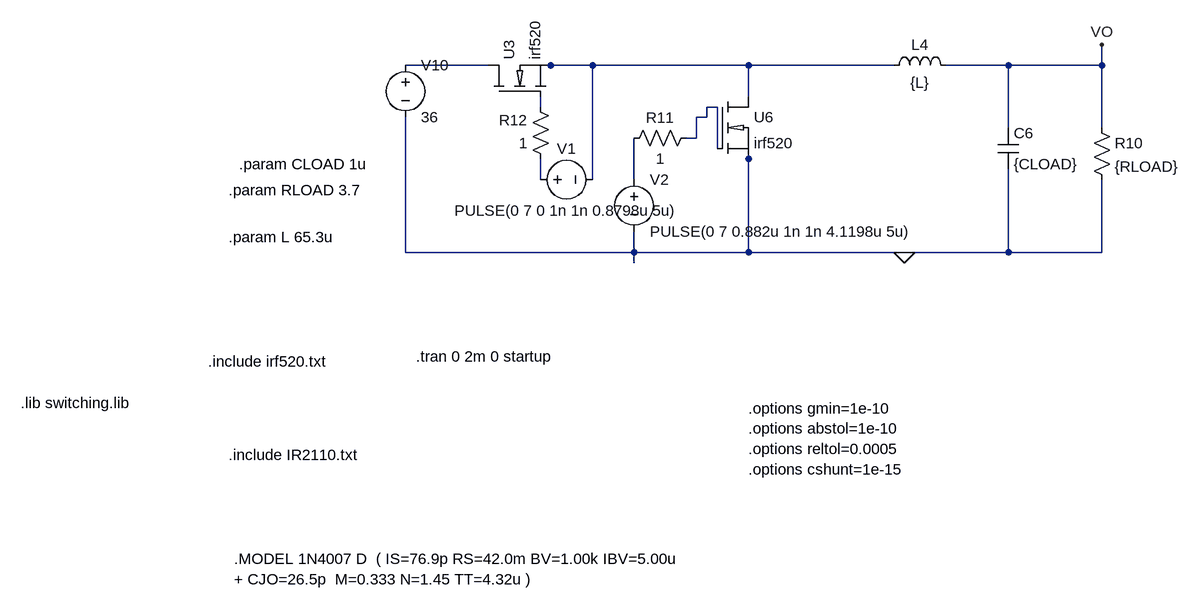
[diagram p0: schematic buck_ideal.asc]
buck_ideal.asc, the LTspice schematic file:
Version 4
SHEET 1 4676 680
WIRE 240 -992 112 -992
WIRE 336 -992 304 -992
WIRE 400 -992 336 -992
WIRE 640 -992 400 -992
WIRE 864 -992 640 -992
WIRE 1040 -992 944 -992
WIRE 1184 -992 1184 -1024
WIRE 1184 -992 1040 -992
WIRE 640 -944 640 -992
WIRE 320 -928 320 -944
WIRE 592 -928 576 -928
WIRE 576 -912 576 -928
WIRE 576 -912 560 -912
WIRE 1040 -896 1040 -992
WIRE 1184 -896 1184 -992
WIRE 560 -880 560 -912
WIRE 560 -880 544 -880
WIRE 592 -864 592 -928
WIRE 640 -848 640 -864
WIRE 320 -816 320 -848
WIRE 400 -816 400 -992
WIRE 464 -816 464 -880
WIRE 112 -704 112 -912
WIRE 464 -704 464 -736
WIRE 464 -704 112 -704
WIRE 640 -704 640 -848
WIRE 640 -704 464 -704
WIRE 880 -704 640 -704
WIRE 1040 -704 1040 -832
WIRE 1040 -704 880 -704
WIRE 1184 -704 1184 -816
WIRE 1184 -704 1040 -704
WIRE 464 -688 464 -704
FLAG 880 -704 0
FLAG 1184 -1024 VO
SYMBOL voltage 112 -1008 R0
WINDOW 123 0 0 Left 0
WINDOW 39 0 0 Left 0
SYMATTR InstName V10
SYMATTR Value 36
SYMBOL ind 848 -976 R270
WINDOW 0 32 56 VTop 2
WINDOW 3 5 56 VBottom 2
SYMATTR InstName L4
SYMATTR Value {L}
SYMBOL cap 1024 -896 R0
SYMATTR InstName C6
SYMATTR Value {CLOAD}
SYMBOL res 1168 -912 R0
SYMATTR InstName R10
SYMATTR Value {RLOAD}
SYMBOL irf520 240 -944 R270
SYMATTR InstName U3
SYMBOL irf520 592 -944 R0
SYMATTR InstName U6
SYMBOL res 560 -896 R90
WINDOW 0 0 56 VBottom 2
WINDOW 3 32 56 VTop 2
SYMATTR InstName R11
SYMATTR Value 1
SYMBOL res 336 -832 R180
WINDOW 0 36 76 Left 2
WINDOW 3 36 40 Left 2
SYMATTR InstName R12
SYMATTR Value 1
SYMBOL voltage 304 -816 R270
WINDOW 0 32 56 VTop 2
WINDOW 3 -32 56 VBottom 2
WINDOW 123 0 0 Left 0
WINDOW 39 0 0 Left 0
SYMATTR InstName V1
SYMATTR Value PULSE(0 7 0 1n 1n 0.8798u 5u)
SYMBOL voltage 464 -832 R0
WINDOW 123 0 0 Left 0
WINDOW 39 0 0 Left 0
SYMATTR InstName V2
SYMATTR Value PULSE(0 7 0.882u 1n 1n 4.1198u 5u)
TEXT 128 -544 Left 2 !.tran 0 2m 0 startup
TEXT -144 -840 Left 2 !.param CLOAD 1u
TEXT -160 -800 Left 2 !.param RLOAD 3.7
TEXT -160 -728 Left 2 !.param L 65.3u
TEXT -192 -536 Left 2 !.include irf520.txt
TEXT -160 -392 Left 2 !.include IR2110.txt
TEXT -152 -232 Left 2 !.MODEL 1N4007 D  ( IS=76.9p RS=42.0m BV=1.00k IBV=5.00u\n+ CJO=26.5p  M=0.333 N=1.45 TT=4.32u )
TEXT 640 -464 Left 2 !.options gmin=1e-10\n.options abstol=1e-10\n.options reltol=0.0005\n.options cshunt=1e-15
TEXT -480 -472 Left 2 !.lib switching.lib

The netlist it stands for:
* buck_ideal.asc
V10 N001 0 36
L4 N002 VO {L}
C6 VO 0 {CLOAD}
R10 VO 0 {RLOAD}
XU3 N001 N003 N002 irf520
XU6 N002 N004 0 irf520
R11 N004 N006 1
R12 N005 N003 1
V1 N005 N002 PULSE(0 7 0 1n 1n 0.8798u 5u)
V2 N006 0 PULSE(0 7 0.882u 1n 1n 4.1198u 5u)
.tran 0 2m 0 startup
.param CLOAD 1u
.param RLOAD 3.7
.param L 65.3u
.include irf520.txt
.include IR2110.txt
.MODEL 1N4007 D  ( IS=76.9p RS=42.0m BV=1.00k IBV=5.00u
+ CJO=26.5p  M=0.333 N=1.45 TT=4.32u )
.options gmin=1e-10
.options abstol=1e-10
.options reltol=0.0005
.options cshunt=1e-15
.lib switching.lib
.lib irf520.txt
.backanno
.end